# EAGLE schematic amplifier (EAGLE 8.7.0)
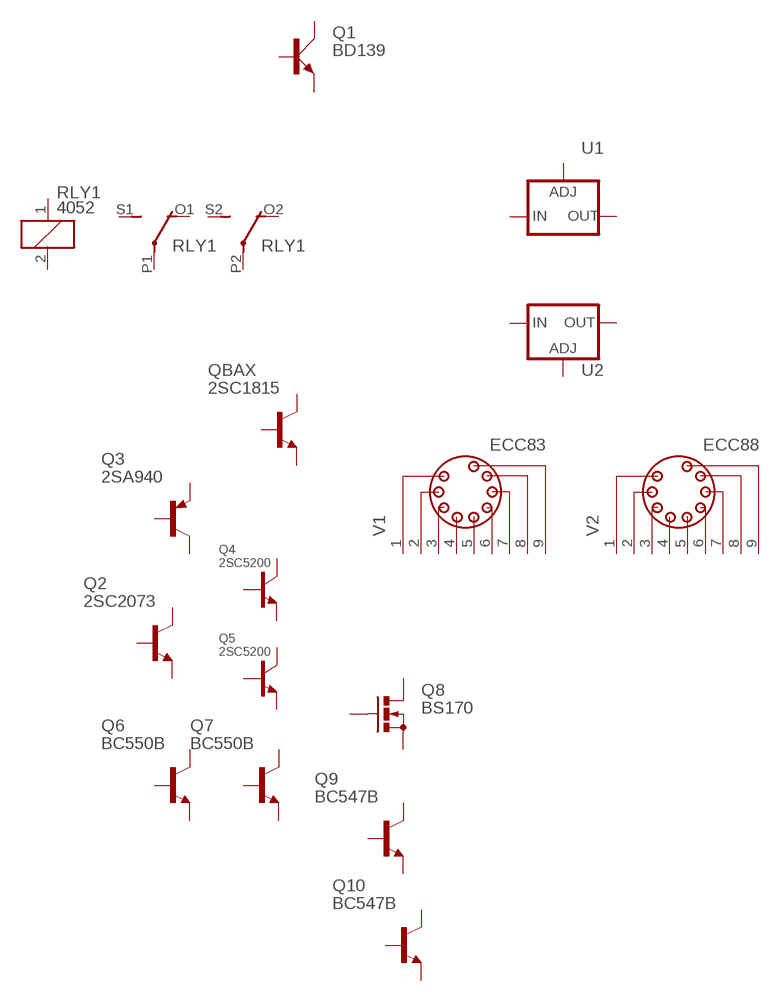
[diagram p0: schematic, sheet 1]

## Parts
Q1  BD139  [TO126AV]
Q2  2SC2073  2SC2098V  [TO220AV]
Q3  2SA940  -PNP-TO220V  [TO220V]
Q4  2SC5200  [TO264]
Q5  2SC5200  [TO264]
Q6  BC550B  [TO92-EBC]
Q7  BC550B  [TO92-EBC]
Q8  BS170  [SOT54E]
Q9  BC547B  BC547B-NPN-TO92-CBE  [TO92-CBE]
Q10  BC547B  BC547B-NPN-TO92-CBE  [TO92-CBE]
QBAX  2SC1815  [TO92-ECB]
RLY1  4052  [F4052]
U1  LM337TS  [337TS]
U2  LM317TS  [317TS]
V1  ECC83  VT9-PT  [VT9-PT]
V2  ECC88  VT9-PT  [VT9-PT]
Unconnected: Q1.B Q1.C Q1.E Q2.1(B) Q2.2(C) Q2.3(E) Q3.1(B) Q3.2(C) Q3.3(E) Q4.1(B) Q4.2(C) Q4.3(E) Q5.1(B) Q5.2(C) Q5.3(E) Q6.B Q6.C Q6.E Q7.B Q7.C Q7.E Q8.D Q8.G Q8.S Q9.B Q9.C Q9.E Q10.B Q10.C Q10.E QBAX.B QBAX.C QBAX.E RLY1.1 RLY1.2 RLY1.O1(2:O) RLY1.O2(3:O) RLY1.P1(2:P) RLY1.P2(3:P) RLY1.S1(2:S) RLY1.S2(3:S) U1.1(ADJ) U1.2(IN) U1.3(OUT) U2.1(ADJ) U2.2(OUT) U2.3(IN) V1.1 V1.2 V1.3 V1.4 V1.5 V1.6 V1.7 V1.8 V1.9 V2.1 V2.2 V2.3 V2.4 V2.5 V2.6 V2.7 V2.8 V2.9

## Library data of the parts
Q1 = transistor-power:BD139: NPN TRANSISTOR
Q2 = transistor-neu-to92:2SC2098: NPN Epitaxial Planar Transistor RF Power Amplivier Source: 2SC2098.pdf
Q3 = transistor-neu-to92:*-PNP-: PNP Transistror
Q4 Q5 = mugen:2SC5200
Q6 Q7 = transistor-npn:BC550*: NPN Transistor
Q8 = transistor-small-signal:BS170: N-CHANNEL MOS FET
Q9 Q10 = transistor:*-NPN-: NPN Transistror BF959 corrected 2008.03.06
QBAX = transistor:2SC1815: NPN EPITAXIAL TRANSISTOR Source: TOSHIBA .. 2SC1815 1.pdf
RLY1 = relay:4052: RELAY 2 x switch, Finder; OC_FARNELL: unknown; OC_NEWARK: unknown
U1 = v-reg:LM337TS: VOLTAGE REGULATOR
U2 = v-reg:LM317TS: VOLTAGE REGULATOR
V1 V2 = belton-engineering:VT9: VACUUM TUBE SOCKET Source: 00004280-VT9-PT.pdf